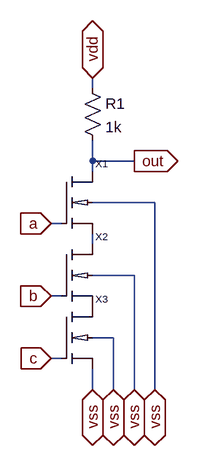
[diagram p0: schematic 3_way_nand.asc]
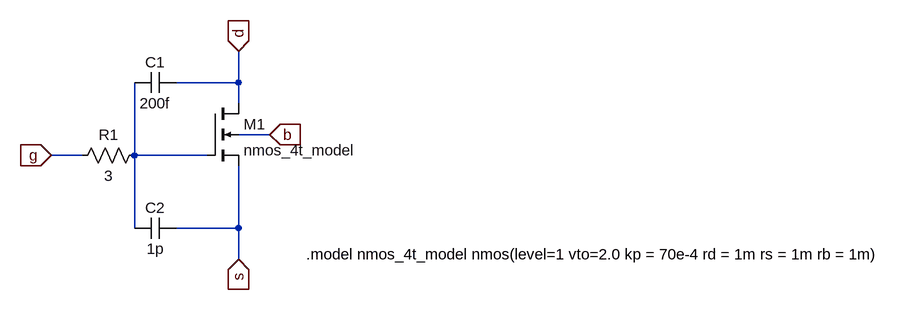
[diagram p1: sub-circuit nmos_4t.asc]
3_way_nand.asc, the LTspice schematic file:
Version 4
SHEET 1 880 680
WIRE -224 -304 -224 -320
WIRE -224 -192 -224 -224
WIRE -160 -192 -224 -192
WIRE -224 -176 -224 -192
WIRE -128 -128 -224 -128
WIRE -272 -96 -288 -96
WIRE -224 -64 -224 -80
WIRE -160 -16 -224 -16
WIRE -272 16 -288 16
WIRE -192 80 -224 80
WIRE -272 112 -288 112
WIRE -224 160 -224 128
WIRE -192 160 -192 80
WIRE -160 160 -160 -16
WIRE -128 160 -128 -128
FLAG -160 -192 out
IOPIN -160 -192 Out
FLAG -288 -96 a
IOPIN -288 -96 In
FLAG -288 16 b
IOPIN -288 16 In
FLAG -224 160 vss
IOPIN -224 160 BiDir
FLAG -224 -320 vdd
IOPIN -224 -320 BiDir
FLAG -288 112 c
IOPIN -288 112 In
FLAG -160 160 vss
IOPIN -160 160 BiDir
FLAG -128 160 vss
IOPIN -128 160 BiDir
FLAG -192 160 vss
IOPIN -192 160 BiDir
SYMBOL res -240 -320 R0
SYMATTR InstName R1
SYMATTR Value 1k
SYMBOL nmos_4t -272 -176 R0
SYMATTR InstName X1
SYMBOL nmos_4t -272 -64 R0
SYMATTR InstName X2
SYMBOL nmos_4t -272 32 R0
SYMATTR InstName X3

nmos_4t.asc, the sub-circuit schematic file:
Version 4
SHEET 1 880 680
WIRE -288 -224 -288 -272
WIRE -288 -224 -384 -224
WIRE -288 -192 -288 -224
WIRE -240 -144 -288 -144
WIRE -528 -112 -576 -112
WIRE -448 -112 -448 -224
WIRE -336 -112 -448 -112
WIRE -448 0 -448 -112
WIRE -288 0 -288 -96
WIRE -288 0 -384 0
WIRE -288 48 -288 0
FLAG -576 -112 g
IOPIN -576 -112 In
FLAG -288 -272 d
IOPIN -288 -272 In
FLAG -288 48 s
IOPIN -288 48 In
FLAG -240 -144 b
IOPIN -240 -144 In
SYMBOL nmos4 -336 -192 R0
SYMATTR InstName M1
SYMATTR Value nmos_4t_model
SYMBOL cap -384 -240 R90
WINDOW 0 0 32 VBottom 2
WINDOW 3 32 32 VTop 2
SYMATTR InstName C1
SYMATTR Value 200f
SYMBOL cap -384 -16 R90
WINDOW 0 0 32 VBottom 2
WINDOW 3 32 32 VTop 2
SYMATTR InstName C2
SYMATTR Value 1p
SYMBOL res -432 -128 R90
WINDOW 0 0 56 VBottom 2
WINDOW 3 32 56 VTop 2
SYMATTR InstName R1
SYMATTR Value 3
TEXT -184 40 Left 2 !.model nmos_4t_model nmos(level=1 vto=2.0 kp = 70e-4 rd = 1m rs = 1m rb = 1m)

The netlist it stands for:
* 3_way_nand.asc
R1 vdd out 1k
XX1 out a N001 vss nmos_4t
XX2 N001 b P001 vss nmos_4t
XX3 P001 c vss vss nmos_4t

* block symbol definitions
.subckt nmos_4t D G S B
M1 d N001 s b nmos_4t_model
C1 d N001 200f
C2 s N001 1p
R1 N001 g 3
.model nmos_4t_model nmos(level=1 vto=2.0 kp = 70e-4 rd = 1m rs = 1m rb = 1m)
.ends nmos_4t

.model NMOS NMOS
.model PMOS PMOS
.lib standard.mos
.backanno
.end